# Altium schematic sheet IMU_board_rev2.SchDoc
size A
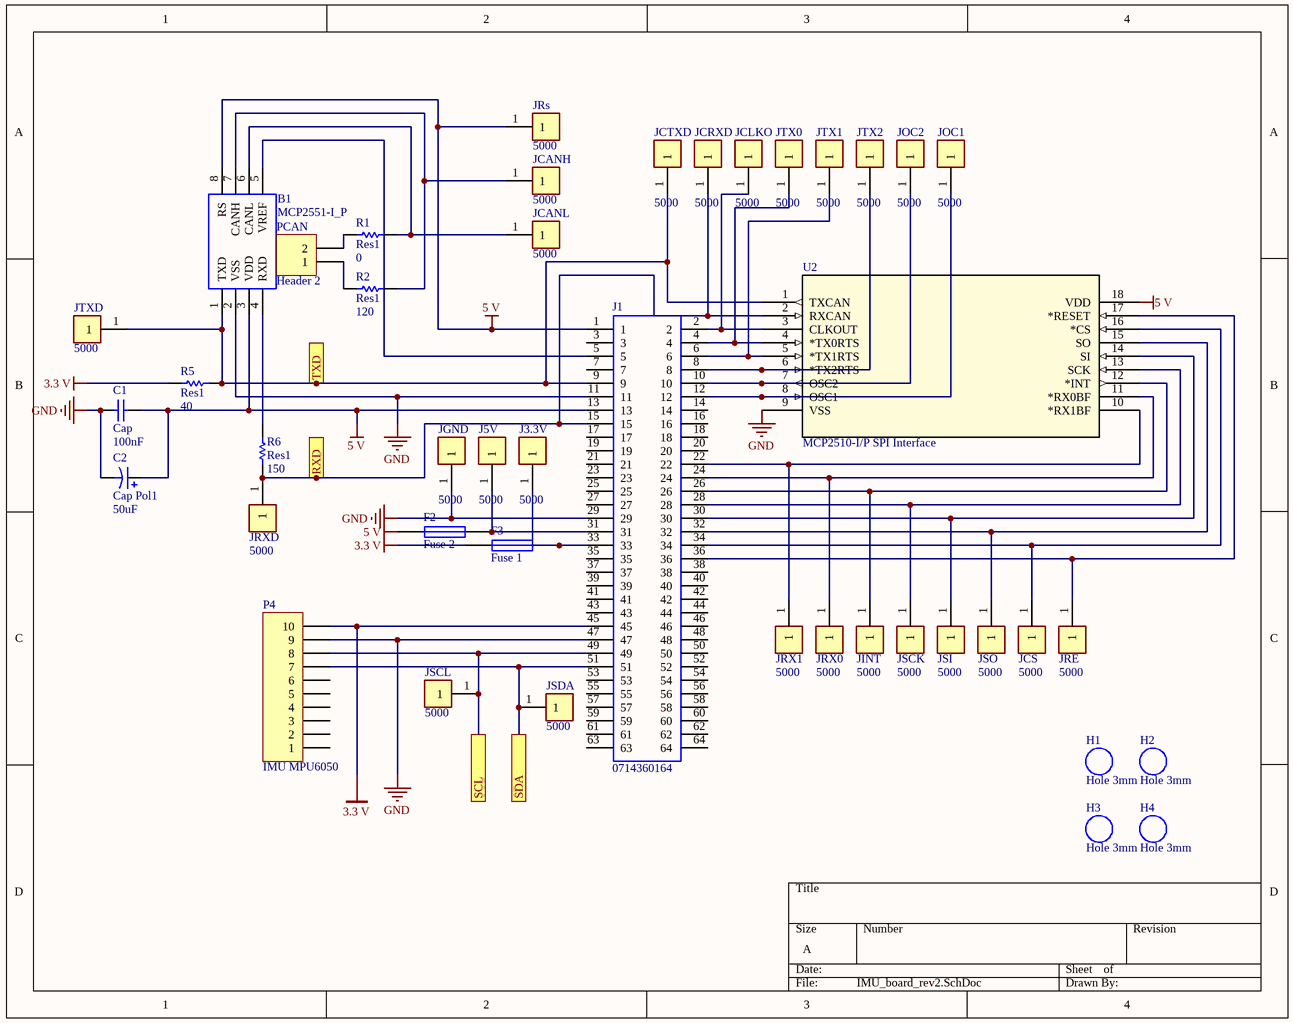
[diagram p0: IMU_board_rev2.SchDoc]

## Parts
B1  MCP2551-I_P  [DIP794W56P254L946H432Q8N]
C1  Cap  value 100nF  [Cap Pol]
C2  Cap Pol1  value 50uF  [Cap Pol]
F2  Fuse 2  [PIN-W2/E2.8]
F3  Fuse 1  [PIN-W2/E2.8]
H1  Hole 3mm  [Hole 3mm]
H2  Hole 3mm  [Hole 3mm]
H3  Hole 3mm  [Hole 3mm]
H4  Hole 3mm  [Hole 3mm]
J1  0714360164  [0714360164]
J3.3V  5000  [KEYSTONE_5000]
J5V  5000  [KEYSTONE_5000]
JCANH  5000  [KEYSTONE_5000]
JCANL  5000  [KEYSTONE_5000]
JCLKO  5000  [KEYSTONE_5000]
JCRXD  5000  [KEYSTONE_5000]
JCS  5000  [KEYSTONE_5000]
JCTXD  5000  [KEYSTONE_5000]
JGND  5000  [KEYSTONE_5000]
JINT  5000  [KEYSTONE_5000]
JOC1  5000  [KEYSTONE_5000]
JOC2  5000  [KEYSTONE_5000]
JRE  5000  [KEYSTONE_5000]
JRs  5000  [KEYSTONE_5000]
JRX0  5000  [KEYSTONE_5000]
JRX1  5000  [KEYSTONE_5000]
JRXD  5000  [KEYSTONE_5000]
JSCK  5000  [KEYSTONE_5000]
JSCL  5000  [KEYSTONE_5000]
JSDA  5000  [KEYSTONE_5000]
JSI  5000  [KEYSTONE_5000]
JSO  5000  [KEYSTONE_5000]
JTX0  5000  [KEYSTONE_5000]
JTX1  5000  [KEYSTONE_5000]
JTX2  5000  [KEYSTONE_5000]
JTXD  5000  [KEYSTONE_5000]
P4  IMU MPU6050  [HDR1X10]
PCAN  Header 2  [HDR1X2]
R1  Res1  value 0  [AXIAL-0.3]
R2  Res1  value 120  [AXIAL-0.3]
R5  Res1  value 40  [AXIAL-0.3]
R6  Res1  value 150  [AXIAL-0.3]
U2  MCP2510-I/P SPI Interface  [PDIP18_300MC_MCH]

## Ports
RXD, SCL, SDA, TXD

## Nets
3.3 V: F3.2 J1.45 P4.10 R5.2
5 V: B1.3(VDD) B1.8(RS) C1.2 C2.1 F2.2 J1.1 J1.13 JRs.1 U2.18(VDD)
GND: B1.2(VSS) C1.1 C2.2 J1.11 J1.29 J1.47 JGND.1 P4.9 U2.9(VSS)
RXD: J1.15 JCRXD.1 JRXD.1 R6.2 U2.2(RXCAN) ; port RXD
SCL: J1.49 JSCL.1 P4.8 ; port SCL
SDA: J1.51 JSDA.1 P4.7 ; port SDA
TXD: B1.1(TXD) J1.9 JCTXD.1 JTXD.1 R5.1 U2.1(TXCAN) ; port TXD
NetB1_4: B1.4(RXD) R6.1
NetB1_5: B1.5(VREF) J1.5
NetB1_6: B1.6(CANL) JCANL.1 R1.2
NetB1_7: B1.7(CANH) JCANH.1 R2.2
NetF2_1: F2.1 J1.31 J5V.1
NetF3_1: F3.1 J1.33 J3.3V.1
NetJ1_2: J1.2 JCLKO.1 U2.3(CLKOUT)
NetJ1_4: J1.4 JTX0.1 U2.4(*TX0RTS)
NetJ1_6: J1.6 JTX1.1 U2.5(*TX1RTS)
NetJ1_8: J1.8 JTX2.1 U2.6(*TX2RTS)
NetJ1_10: J1.10 JOC2.1 U2.7(OSC2)
NetJ1_12: J1.12 JOC1.1 U2.8(OSC1)
NetJ1_22: J1.22 JRX1.1 U2.10(*RX1BF)
NetJ1_24: J1.24 JRX0.1 U2.11(*RX0BF)
NetJ1_26: J1.26 JINT.1 U2.12(*INT)
NetJ1_28: J1.28 JSCK.1 U2.13(SCK)
NetJ1_30: J1.30 JSI.1 U2.14(SI)
NetJ1_32: J1.32 JSO.1 U2.15(SO)
NetJ1_34: J1.34 JCS.1 U2.16(*CS)
NetJ1_36: J1.36 JRE.1 U2.17(*RESET)
NetPCAN_1: PCAN.1 R2.1
NetPCAN_2: PCAN.2 R1.1

Not connected (* = marked no-connect by the designer): J1 3 7 14 16 17 18 19 20 21 23 25 27 35 37 38 39 40 41 42 43 44 46 48 50 52 53 54 55 56 57 58 59 60 61 62 63 64; P4 1 2 3 4 5 6

## Library data of the parts
B1 = MCP2551-I_P: High Speed CAN Transceiver,MCP2551-I/P Microchip MCP2551-I/P, CAN Transceiver 1-channel ISO 11898, 8-Pin PDIP; Geometry.Height: 4.32mm; Manufacturer_Name: Microchip; Manufacturer_Part_Number: MCP2551-I/P; Mouser Part Number: 579-MCP2551-I/P; Mouser Price/Stock: https://www.mouser.co.uk/ProductDetail/Microchip-Technology-Atmel/MCP2551-I-P?qs=8g3RLJaa2Uis1lC9gEMPXA%3D%3D; Arrow Part Number: MCP2551-I/P; Arrow Price/Stock: https://www.arrow.com/en/products/mcp2551-ip/microchip-technology?region=nac; Mouser Testing Part Number: *; Mouser Testing Price/Stock: *; Datasheet Link: http://www.mouser.com/ds/2/268/21667d-63675.pdf
C1 = Cap: Capacitor; Published: 8-Jun-2000; LatestRevisionDate: 17-Jul-2002; LatestRevisionNote: Re-released for DXP Platform.; PackageReference: RAD-0.3; Publisher: Altium Limited; PackageDescription: Radial Cap, Thru-Hole; 2 Leads; 0.3 in Pin Spacing
C2 = Cap Pol1: Polarized Capacitor (Radial); Published: 8-Jun-2000; LatestRevisionDate: 17-Jul-2002; LatestRevisionNote: Re-released for DXP Platform.; PackageReference: RB7.6-15; Publisher: Altium Limited; PackageDescription: Polarized Capacitor (Radial); 2 Leads
F2 F3 = Fuse 1: Fuse; Published: 8-Jun-2000; LatestRevisionDate: 17-Jul-2002; LatestRevisionNote: Re-released for DXP Platform.; PackageReference: PIN-W2/E2.8; Publisher: Altium Limited; PackageDescription: Thru-Hole; 2 Leads
J1 = 0714360164: Board to Board & Mezzanine Connectors 1.00MM PLG 02X32P VT SMT; Manufacturer_Name: Molex; Geometry.Height: 7.48mm; Manufacturer_Part_Number: 0714360164; Mouser Part Number: N/A; Mouser Price/Stock: https://www.mouser.com/Search/Refine.aspx?Keyword=N%2FA; Arrow Part Number: 0714360164; Arrow Price/Stock: https://www.arrow.com/en/products/0714360164/molex; Mouser Testing Part Number: *; Mouser Testing Price/Stock: *; Datasheet Link: https://www.molex.com/pdm_docs/sd/714360164_sd.pdf
J3.3V J5V JCANH JCANL JCLKO JCRXD JCS JCTXD JGND JINT JOC1 JOC2 JRE JRs JRX0 JRX1 JRXD JSCK JSCL JSDA JSI JSO JTX0-JTX2 JTXD = 5000: MF: Keystone; MP: 5000; Package: Custom Package Ohmite; Availability: Good; Price: None; Purchase-URL: https://pricing.snapeda.com/search/part/5000/?ref=eda; SnapEDA_Link: https://www.snapeda.com/parts/5000/Keystone/view-part/883846/?ref=snap; Value: *
P4 = Header 10: Header, 10-Pin; LatestRevisionDate: 17-Jul-2002; LatestRevisionNote: Re-released for DXP Platform.; Publisher: Altium Limited
PCAN = Header 2: Header, 2-Pin; LatestRevisionDate: 17-Jul-2002; LatestRevisionNote: Re-released for DXP Platform.; Publisher: Altium Limited
R1 R2 R5 R6 = Res1: Resistor; Published: 8-Jun-2000; LatestRevisionDate: 17-Jul-2002; LatestRevisionNote: Re-released for DXP Platform.; PackageReference: AXIAL-0.3; Publisher: Altium Limited; PackageDescription: Axial Device, Thru-Hole; 2 Leads; 0.3 in Pin Spacing
U2 = MCP2510-I/P: No Description Available; Mfr_Name: Microchip; Copyright: Copyright (C) 2022 Ultra Librarian. All rights reserved.; Manufacturer_Part_Number: MCP2510-I/P; RefDes: RefDes; Type: DEV